# Altium schematic sheet OMD_DRIVER_60V.SchDoc
size A3; Organization: Altium Limited; Address1: L3, 12a Rodborough Rd; Address2: Frenchs Forest; Address3: NSW; Address4: Australia 2086
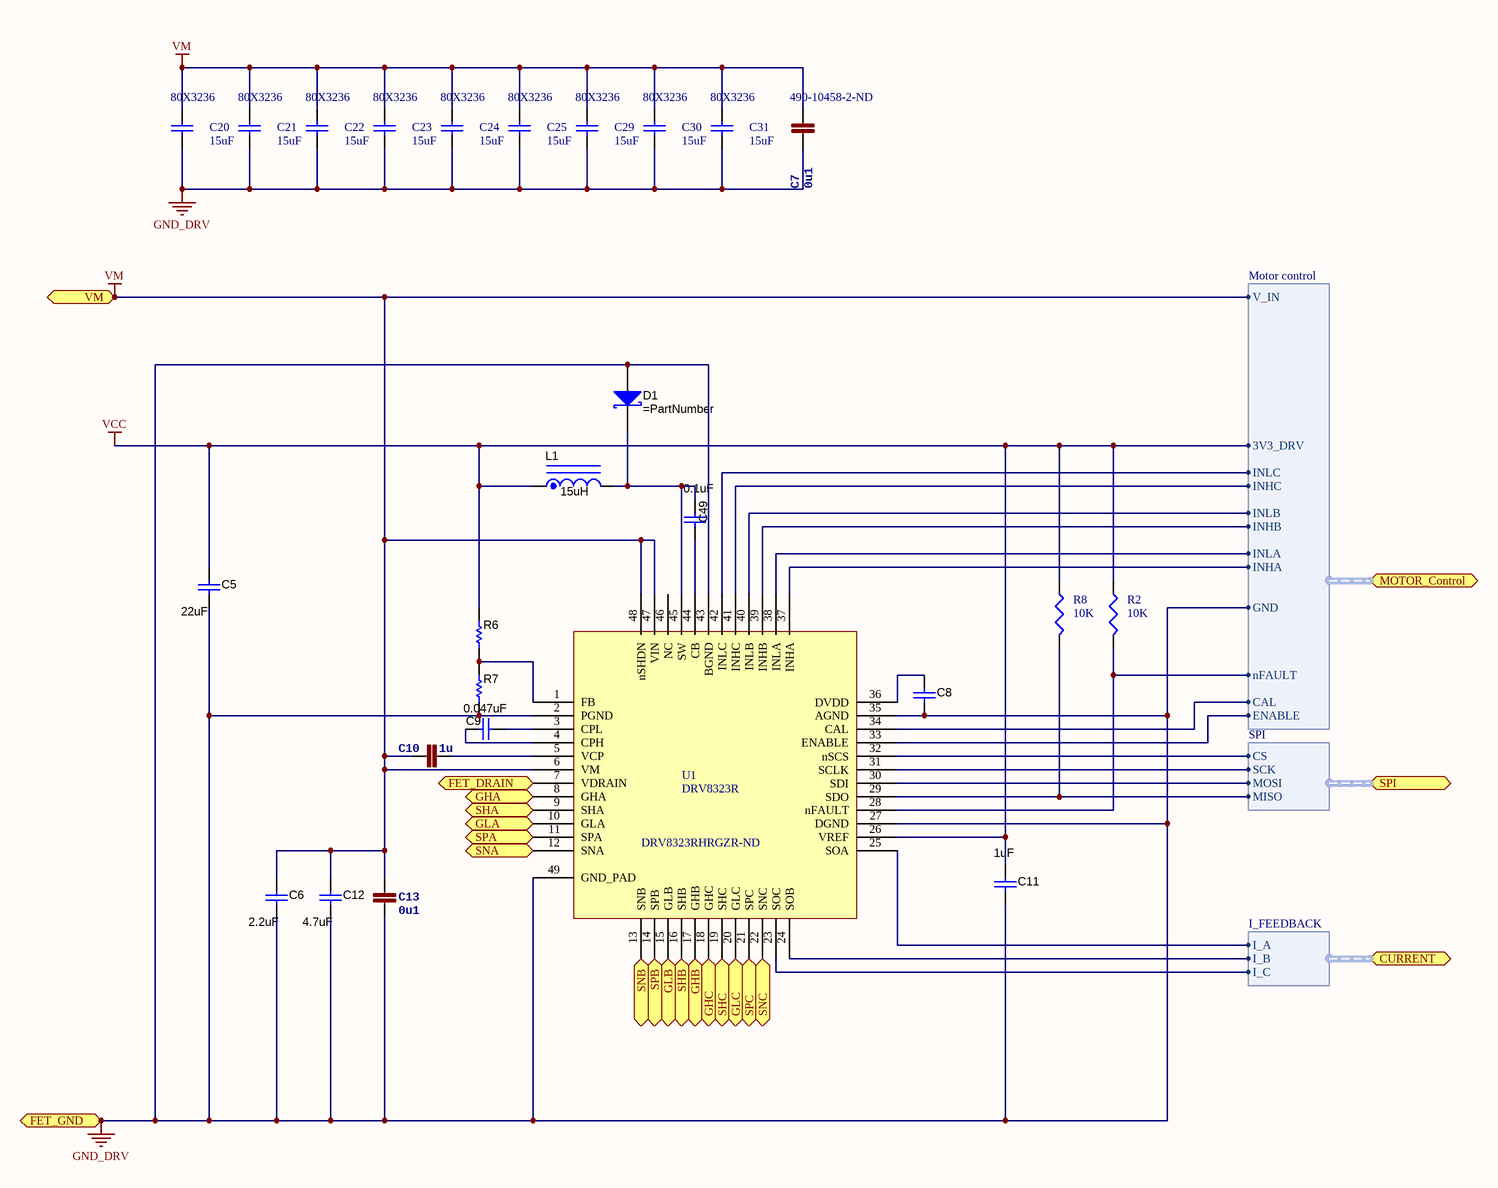
[diagram p0: OMD_DRIVER_60V.SchDoc]

## Parts
C5  value 22uF  [1206_180L]
C6  value 2.2uF  [1210L]
C7  0u1  Supplier Part Number 1: 490-10458-2-ND  [0402-CAP]
C8  (no value)  [0603-CAP]
C9  value 0.047uF  [0603-CAP]
C10  1u  [0805-CAP]
C11  value 1uF  [0603-CAP]
C12  value 4.7uF  [1210_270L]
C13  0u1  [0402-CAP]
C20  value 15uF  Supplier Part Number 1: 80X3236  [CAPC5750L]  (hidden comment: Cap)
C21  value 15uF  Supplier Part Number 1: 80X3236  [CAPC5750L]  (hidden comment: Cap)
C22  value 15uF  Supplier Part Number 1: 80X3236  [CAPC5750L]  (hidden comment: Cap)
C23  value 15uF  Supplier Part Number 1: 80X3236  [CAPC5750L]  (hidden comment: Cap)
C24  value 15uF  Supplier Part Number 1: 80X3236  [CAPC5750L]  (hidden comment: Cap)
C25  value 15uF  Supplier Part Number 1: 80X3236  [CAPC5750L]  (hidden comment: Cap)
C29  value 15uF  Supplier Part Number 1: 80X3236  [CAPC5750L]  (hidden comment: Cap)
C30  value 15uF  Supplier Part Number 1: 80X3236  [CAPC5750L]  (hidden comment: Cap)
C31  value 15uF  Supplier Part Number 1: 80X3236  [CAPC5750L]  (hidden comment: Cap)
C49  value 0.1uF  [0603-CAP]
D1  (no value)  [SOD-123FL]
L1  value 15uH  [SD53]
R2  value 10K  [0402-RES]  (hidden comment: RES SMD 10K OHM 5% 1/16W 0402)
R6  (no value)  [0603L]
R7  (no value)  [0603L]
R8  value 10K  [0402-RES]  (hidden comment: RES SMD 10K OHM 5% 1/16W 0402)
U1  DRV8323R  Supplier Part Number 1: DRV8323RHRGZR-ND  [PQFP-G48]

## Ports
CURRENT (harness I_FEEDBACK), FET_DRAIN, FET_GND, GHA, GHB, GHC, GLA, GLB, GLC, MOTOR_Control (harness Motor control), SHA, SHB, SHC, SNA, SNB, SNC, SPA, SPB, SPC, SPI (harness SPI), VM

## Harnesses
SPI: SCK, MISO, MOSI, CS
I_FEEDBACK: I_A, I_B, I_C
Motor control: 3V3_DRV, INHA, INLA, INHB, INLB, INHC, INLC, nFAULT, V_IN, GND, CAL, ENABLE

## Nets
GND_DRV: C5.2 C6.2 C7.P$2 C8.2 C11.1 C12.2 C13.P$2 C20.1 C21.1 C22.1 C23.1 C24.1 C25.1 C29.1 C30.1 C31.1 D1.2(A) R7.1 U1.2(PGND) U1.27(DGND) U1.35(AGND) U1.43(BGND) U1.49(GND_PAD) ; port FET_GND, port MOTOR_Control.GND
VCC: C5.1 C11.2 L1.1 R2.1 R6.2 R8.1 U1.26(VREF) ; port MOTOR_Control.3V3_DRV
VM: C6.1 C7.P$1 C10.2 C12.1 C13.P$1 C20.2 C21.2 C22.2 C23.2 C24.2 C25.2 C29.2 C30.2 C31.2 U1.6(VM) U1.47(VIN) U1.48(nSHDN) ; port VM, port MOTOR_Control.V_IN
FET_DRAIN: U1.7(VDRAIN) ; port FET_DRAIN
GHA: U1.8(GHA) ; port GHA
GHB: U1.17(GHB) ; port GHB
GHC: U1.18(GHC) ; port GHC
GLA: U1.10(GLA) ; port GLA
GLB: U1.15(GLB) ; port GLB
GLC: U1.20(GLC) ; port GLC
SHA: U1.9(SHA) ; port SHA
SHB: U1.16(SHB) ; port SHB
SHC: U1.19(SHC) ; port SHC
SNA: U1.12(SNA) ; port SNA
SNB: U1.13(SNB) ; port SNB
SNC: U1.22(SNC) ; port SNC
SPA: U1.11(SPA) ; port SPA
SPB: U1.14(SPB) ; port SPB
SPC: U1.21(SPC) ; port SPC
NetC8_1: C8.1 U1.36(DVDD)
NetC9_1: C9.1 U1.3(CPL)
NetC9_2: C9.2 U1.4(CPH)
NetC10_1: C10.1 U1.5(VCP)
NetC49_1: C49.1 D1.1(K) L1.2 U1.45(SW)
NetC49_2: C49.2 U1.44(CB)
NetR2_2: R2.2 U1.28(nFAULT) ; port MOTOR_Control.nFAULT
NetR6_1: R6.1 R7.2 U1.1(FB)
NetR8_2: R8.2 U1.29(SDO) ; port SPI.MISO
NetU1_23: U1.23(SOC) ; port CURRENT.I_C
NetU1_24: U1.24(SOB) ; port CURRENT.I_B
NetU1_25: U1.25(SOA) ; port CURRENT.I_A
NetU1_30: U1.30(SDI) ; port SPI.MOSI
NetU1_31: U1.31(SCLK) ; port SPI.SCK
NetU1_32: U1.32(nSCS) ; port SPI.CS
NetU1_33: U1.33(ENABLE) ; port MOTOR_Control.ENABLE
NetU1_34: U1.34(CAL) ; port MOTOR_Control.CAL
NetU1_37: U1.37(INHA) ; port MOTOR_Control.INHA
NetU1_38: U1.38(INLA) ; port MOTOR_Control.INLA
NetU1_39: U1.39(INHB) ; port MOTOR_Control.INHB
NetU1_40: U1.40(INLB) ; port MOTOR_Control.INLB
NetU1_41: U1.41(INHC) ; port MOTOR_Control.INHC
NetU1_42: U1.42(INLC) ; port MOTOR_Control.INLC

Not connected (* = marked no-connect by the designer): U1 46(NC)

## Notes on the sheet
- https://github.com/OpenMotorDrive
- https://creativecommons.org/licenses/by-nc-sa/4.0/
- Title
- Size:
- Date:
- A3
- Number:
- Time:
- Revision:
- Sheet
- of
- ProfiCNC Pty. Ltd.
- For Commercial use, please contact ProfiCNC
- ProfiCNC does NOT guaranty these drawings as fit for any purpose, you must verify this information before attempting to use it in any way.  USE AT OWN RISK
- File:

## Library data of the parts
C5 = C3216X7S1A226M160AC: CAP, CERM, 22 µF, 10 V, +/- 20%, X7S, 1206; Supplier 1: Digi-Key; Supplier Part Number 1: 445-8035-1-ND
C6 = HMK325B7225KN-T: CAP, CERM, 2.2 µF, 100 V, +/- 10%, X7R, 1210; Supplier 1: Digi-Key; Supplier Part Number 1: 587-1778-1-ND
C7 C13 = CAP0402: CAP CER 0.1UF 16V Y5V 0402; Value: 0u1; Supplier 1: Digi-Key
  C13: Supplier Part Number 1: 490-10458-2-ND
C8 = GRM188R70J105KA01D: CAP, CERM, 1 µF, 6.3 V, +/- 10%, X7R, 0603; Value: 1uF; Supplier 1: Digi-Key; Supplier Part Number 1: 490-3898-1-ND
C9 = C1608X7S2A473K080AB: CAP, CERM, 0.047 µF, 100 V, +/- 10%, X7S, 0603; Supplier 1: Digi-Key; Supplier Part Number 1: 445-6032-1-ND
C10 = CAP0603: CAP CER 1UF 16V Y5V 0603; Value: 1u; Supplier 1: Digi-Key; Supplier Part Number 1: 490-14464-2-ND
C11 = GRM188R70J105KA01D: CAP, CERM, 1 µF, 6.3 V, +/- 10%, X7R, 0603; Supplier 1: Digi-Key; Supplier Part Number 1: 490-3898-1-ND
C12 = GRM32ER71K475KE14L: CAP, CERM, 4.7 µF, 80 V, +/- 10%, X7R, 1210; Supplier 1: Digi-Key; Supplier Part Number 1: 490-9972-1-ND
C20-C25 C29-C31 = Cap: Capacitor; Supplier 1: Newark
C49 = 0603YC104JAT2A: CAP, CERM, 0.1 µF, 16 V, +/- 5%, X7R, 0603; Supplier 1: Digi-Key; Supplier Part Number 1: 478-3726-1-ND
D1 = MBR1H100SFT3G: Diode, Schottky, 100 V, 1 A, SOD-123FL; Value: 100V; Supplier 1: Digi-Key; Supplier Part Number 1: MBR1H100SFT3GOSCT-ND
L1 = SD53-150-R: Inductor, Shielded Drum Core, Ferrite, 15 µH, 1.1 A, 0.122 ohm, SMD; Supplier 1: Digi-Key; Supplier Part Number 1: 513-1458-1-ND
R2 R8 = Resistor: Supplier 1: Digi-Key; Supplier Part Number 1: 311-10KJRTR-ND
R6 = CRCW060328K0FKEA: RES, 28.0 k, 1%, 0.1 W, 0603; Value: 28.0k; Supplier 1: Digi-Key; Supplier Part Number 1: 541-28.0KHCT-ND
R7 = CRCW06038K45FKEA: RES, 8.45 k, 1%, 0.1 W, 0603; Value: 8.45k; Supplier 1: Digi-Key; Supplier Part Number 1: 541-8.45KHCT-ND
U1 = DRV8323R: Supplier 1: Digi-Key